# Altium schematic sheet Sheet1.SchDoc
size A; SheetNumber: 1; SheetTotal: 3; SPICEModelCacheGCVOIQGJ: <root> / <DocumentId>GCVOIQGJ</DocumentId> / </root>
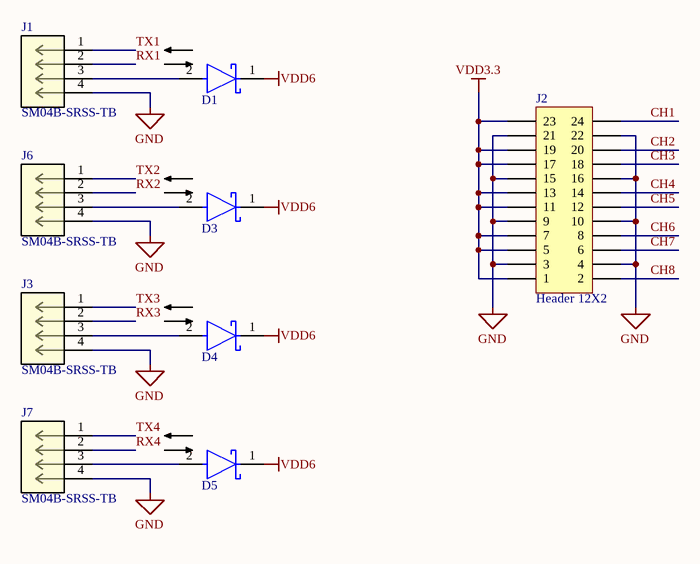
[diagram p0: Sheet1.SchDoc]

## Parts
D1  VS-10MQ100NTRPBF  [FP-95400-MFG]  (value not drawn)
D3  VS-10MQ100NTRPBF  [FP-95400-MFG]  (value not drawn)
D4  VS-10MQ100NTRPBF  [FP-95400-MFG]  (value not drawn)
D5  VS-10MQ100NTRPBF  [FP-95400-MFG]  (value not drawn)
J1  SM04B-SRSS-TB  [CONN_SM04B-SRSS-TB_JST]
J2  Header 12X2  [jst_pad24]
J3  SM04B-SRSS-TB  [CONN_SM04B-SRSS-TB_JST]
J6  SM04B-SRSS-TB  [CONN_SM04B-SRSS-TB_JST]
J7  SM04B-SRSS-TB  [CONN_SM04B-SRSS-TB_JST]

## Nets
GND: J1.4 J2.3 J2.4 J2.9 J2.10 J2.15 J2.16 J2.21 J2.22 J3.4 J6.4 J7.4
VDD3.3: J2.1 J2.5 J2.7 J2.11 J2.13 J2.17 J2.19 J2.23
VDD6: D1.1(C) D3.1(C) D4.1(C) D5.1(C)
CH1: J2.24
CH2: J2.20
CH3: J2.18
CH4: J2.14
CH5: J2.12
CH6: J2.8
CH7: J2.6
CH8: J2.2
RX1: J1.2
RX2: J6.2
RX3: J3.2
RX4: J7.2
TX1: J1.1
TX2: J6.1
TX3: J3.1
TX4: J7.1
NetD1_2: D1.2(A) J1.3
NetD3_2: D3.2(A) J6.3
NetD4_2: D4.2(A) J3.3
NetD5_2: D5.2(A) J7.3

## Library data of the parts
D1 D3-D5 = CMP-02539-000001-1: DIODE SCHOTTKY 100V 1A SMA; Manufacturer: Vishay; Forward Current: 1.5A; Max Surge Forward Current: 30A; Standoff Height: 0mm; Value: 38pF; Max Junction Temp: +150°C; Peak Reverse Current: 0.1mA; Octopart: https://octopart.com/vs-10mq100ntrpbf-vishay-44340924; Max Repetitive Reverse Voltage: 100V; ComponentLink2Description: Datasheet; ComponentLink2URL: http://www.vishay.com/docs/94119/vs-10mq100ntrpbf.pdf; Reverse Voltage: 100V; Digikey Description: DIODE SCHOTTKY 100V 1A SMA; Mouser Description: DIODE SCHOTTKY 100V 1A SMA; Lead Free: Yes; Device Class L2: Diodes; Temperature Range Low: -55°C; Package: 95400; Height: 2.29mm; Capacitance: 38pF; Device Class L1: Discrete Semiconductors; Footprint Url: https://www.vishay.com/docs/95400/sma.pdf; Temperature: -55°C to +150°C; Temperature Range High: +150°C; RoHS: TRUE; Category: Diode; Manufacturer Part Number: VS-10MQ100NTRPBF; Device Class L3: Schottky Diodes; Automotive: No; LCSC: C14996
J1 J3 J6 J7 = SM04B-SRSS-TB: No Description Available; Mfr_Name: JST; RefDes: RefDes; Type: Type; LCSC: C160404
J2 = Header 12X2: Header, 12-Pin, Dual row; LatestRevisionDate: 17-Jul-2002; LatestRevisionNote: Re-released for DXP Platform.; Publisher: Altium Limited; LCSC: C2845846